# Altium schematic sheet Flex_debugging.SchDoc: Flex_debugging
size Letter; CompanyName: Hello Inc.; DrawnBy: D. Fusi; Revision: 1
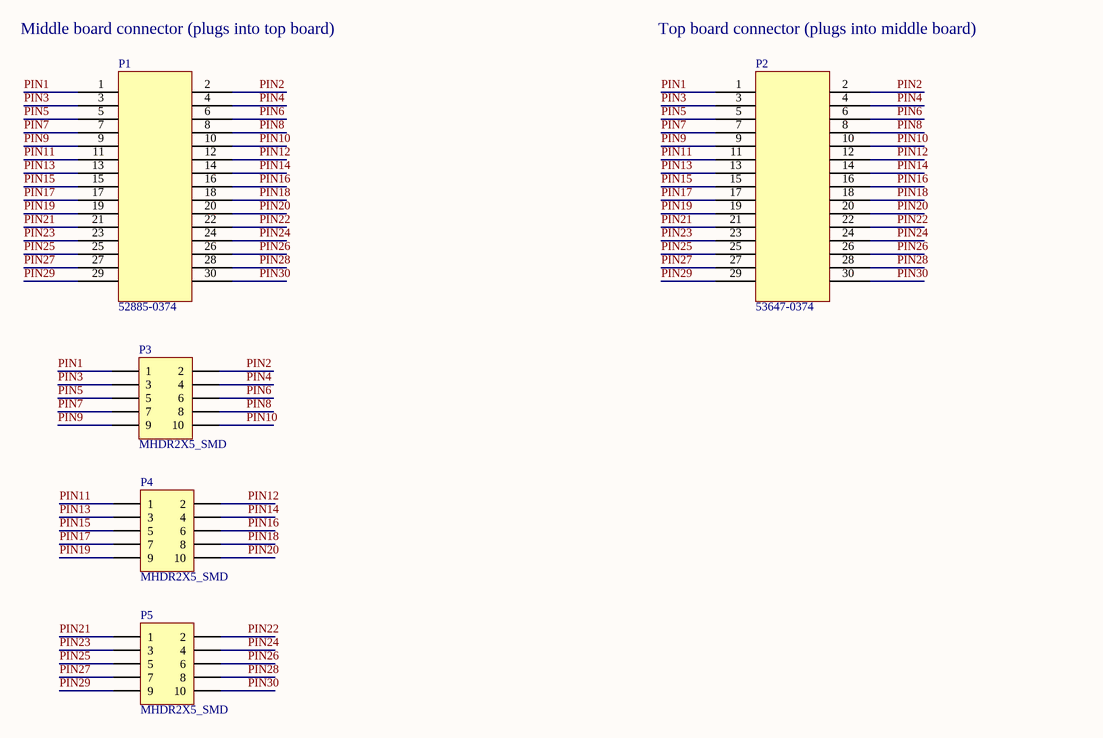
[diagram p0: Flex_debugging.SchDoc]

## Parts
P1  52885-0374  [molex_52885-0374]
P2  53647-0374  [molex_53647-0374]
P3  MHDR2X5_SMD  [MHDR2X5_SMD]
P4  MHDR2X5_SMD  [MHDR2X5_SMD]
P5  MHDR2X5_SMD  [MHDR2X5_SMD]

## Nets
PIN1: P1.1 P2.1 P3.1
PIN2: P1.2 P2.2 P3.2
PIN3: P1.3 P2.3 P3.3
PIN4: P1.4 P2.4 P3.4
PIN5: P1.5 P2.5 P3.5
PIN6: P1.6 P2.6 P3.6
PIN7: P1.7 P2.7 P3.7
PIN8: P1.8 P2.8 P3.8
PIN9: P1.9 P2.9 P3.9
PIN10: P1.10 P2.10 P3.10
PIN11: P1.11 P2.11 P4.1
PIN12: P1.12 P2.12 P4.2
PIN13: P1.13 P2.13 P4.3
PIN14: P1.14 P2.14 P4.4
PIN15: P1.15 P2.15 P4.5
PIN16: P1.16 P2.16 P4.6
PIN17: P1.17 P2.17 P4.7
PIN18: P1.18 P2.18 P4.8
PIN19: P1.19 P2.19 P4.9
PIN20: P1.20 P2.20 P4.10
PIN21: P1.21 P2.21 P5.1
PIN22: P1.22 P2.22 P5.2
PIN23: P1.23 P2.23 P5.3
PIN24: P1.24 P2.24 P5.4
PIN25: P1.25 P2.25 P5.5
PIN26: P1.26 P2.26 P5.6
PIN27: P1.27 P2.27 P5.7
PIN28: P1.28 P2.28 P5.8
PIN29: P1.29 P2.29 P5.9
PIN30: P1.30 P2.30 P5.10

## Notes on the sheet
- (near P1) Middle board connector (plugs into top board)
- (near P2) Top board connector (plugs into middle board)
- TITLE
- DATE
- DRAWN BY
- REV
- SHEET
- OF

## Library data of the parts
P1 = molex_52885-0374: Molex 30-pin 0.635mm pitch receptacle connector; PN: 52885-0374; Vendor: Molex
P2 = molex_53647-0374: Molex 30-pin 0.635mm pitch plug connector; PN: 53647-0374; Vendor: Molex
P3-P5 = MHDR2X5_SMD: Header, 10-Pin, Dual row SMD; PN: GRPB052VWQS-RC; Vendor: Sullins Interconnect